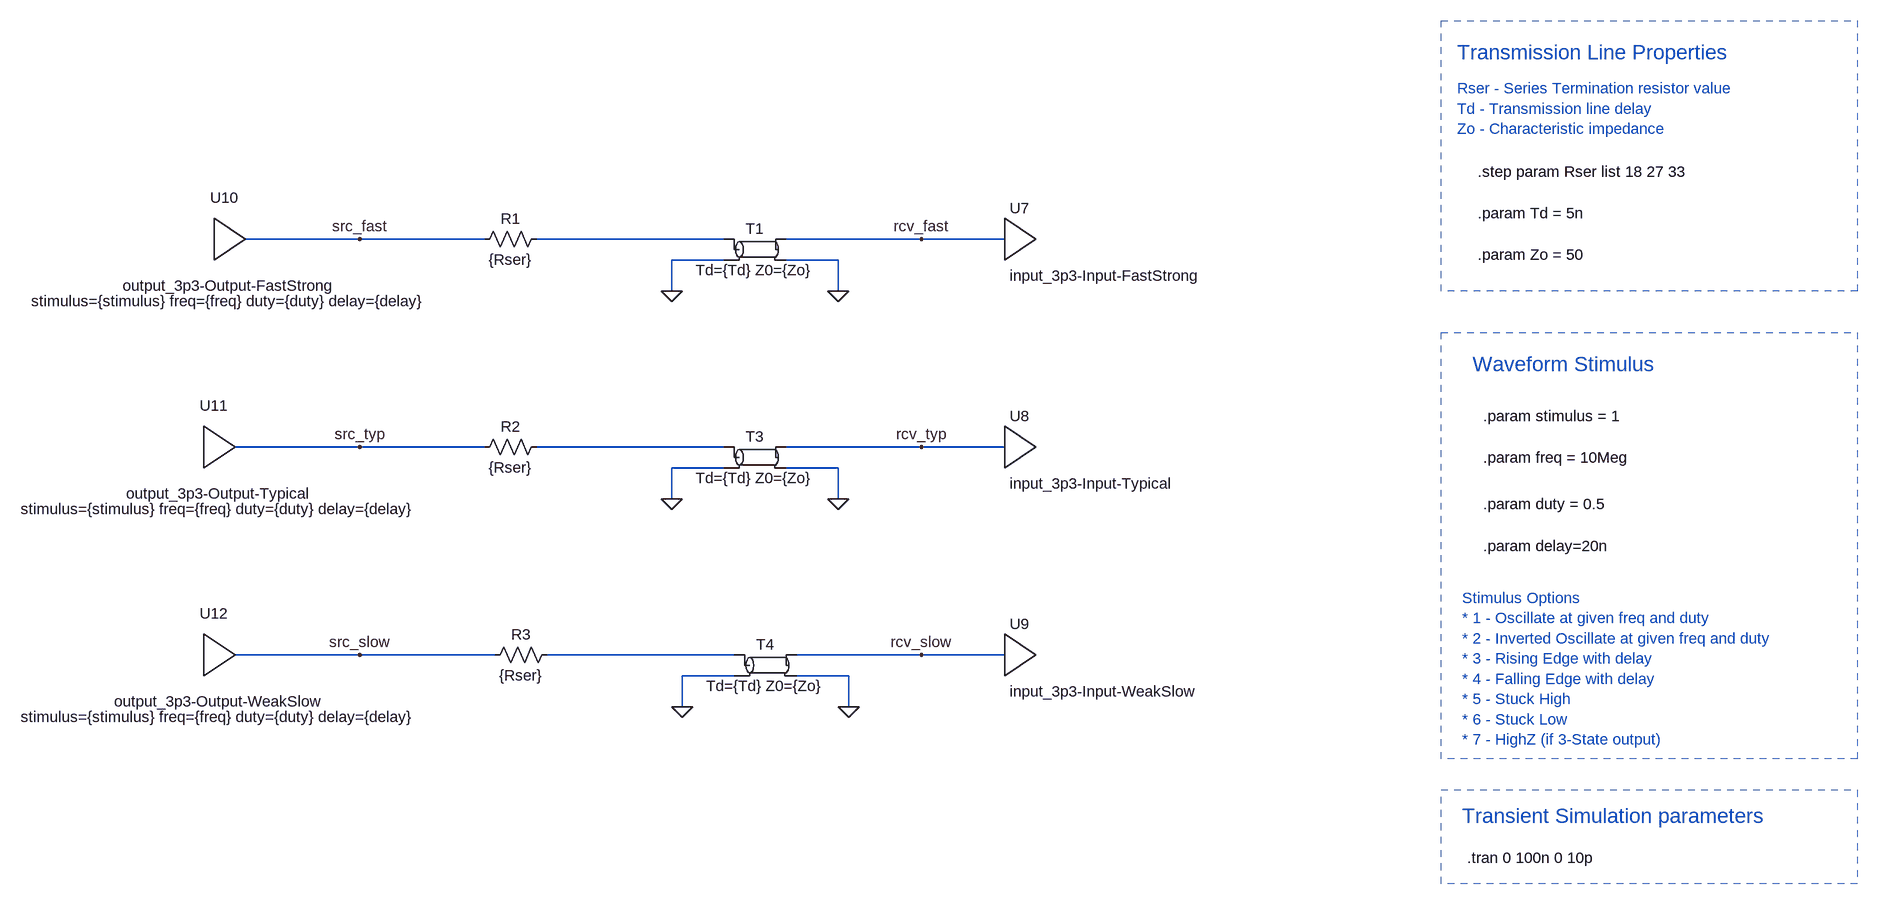
[diagram p0: schematic sn74lv1t34_33.asc]
sn74lv1t34_33.asc, the LTspice schematic file:
Version 4
SHEET 1 2068 1396
WIRE -240 304 -416 304
WIRE -48 304 -240 304
WIRE 320 304 32 304
WIRE 624 304 416 304
WIRE 752 304 624 304
WIRE 320 336 240 336
WIRE 496 336 416 336
WIRE 240 384 240 336
WIRE 496 384 496 336
WIRE -240 624 -432 624
WIRE -48 624 -240 624
WIRE 320 624 32 624
WIRE 624 624 416 624
WIRE 752 624 624 624
WIRE 320 656 240 656
WIRE 496 656 416 656
WIRE 240 704 240 656
WIRE 496 704 496 656
WIRE -240 944 -432 944
WIRE -32 944 -240 944
WIRE 336 944 48 944
WIRE 624 944 432 944
WIRE 752 944 624 944
WIRE 336 976 256 976
WIRE 512 976 432 976
WIRE 256 1024 256 976
WIRE 512 1024 512 976
FLAG 624 304 rcv_fast
FLAG 624 624 rcv_typ
FLAG 624 944 rcv_slow
FLAG -240 304 src_fast
FLAG -240 624 src_typ
FLAG -240 944 src_slow
FLAG 240 704 0
FLAG 496 704 0
FLAG 256 1024 0
FLAG 512 1024 0
FLAG 240 384 0
FLAG 496 384 0
SYMBOL res 48 288 R90
WINDOW 0 0 56 VBottom 2
WINDOW 3 32 56 VTop 2
SYMATTR InstName R1
SYMATTR Value {Rser}
SYMBOL res 48 608 R90
WINDOW 0 0 56 VBottom 2
WINDOW 3 32 56 VTop 2
SYMATTR InstName R2
SYMATTR Value {Rser}
SYMBOL res 64 928 R90
WINDOW 0 0 56 VBottom 2
WINDOW 3 32 56 VTop 2
SYMATTR InstName R3
SYMATTR Value {Rser}
SYMBOL tline 368 640 R0
SYMATTR InstName T3
SYMATTR Value Td={Td} Z0={Zo}
SYMBOL tline 384 960 R0
SYMATTR InstName T4
SYMATTR Value Td={Td} Z0={Zo}
SYMBOL tline 368 320 R0
SYMATTR InstName T1
SYMATTR Value Td={Td} Z0={Zo}
SYMBOL input_3p3-Input-FastStrong 752 240 R0
SYMATTR InstName U7
SYMBOL input_3p3-Input-Typical 752 560 R0
SYMATTR InstName U8
SYMBOL input_3p3-Input-WeakSlow 752 880 R0
SYMATTR InstName U9
SYMBOL output_3p3-Output-FastStrong -448 336 R0
SYMATTR InstName U10
SYMATTR SpiceLine stimulus={stimulus} freq={freq} duty={duty} delay={delay}
SYMBOL output_3p3-Output-Typical -464 656 R0
SYMATTR InstName U11
SYMATTR SpiceLine stimulus={stimulus} freq={freq} duty={duty} delay={delay}
SYMBOL output_3p3-Output-WeakSlow -464 976 R0
SYMATTR InstName U12
SYMATTR SpiceLine stimulus={stimulus} freq={freq} duty={duty} delay={delay}
TEXT 1464 1256 Left 2 !.tran 0 100n 0 10p
TEXT 1480 200 Left 2 !.step param Rser list 18 27 33
TEXT 1480 264 Left 2 !.param Td = 5n
TEXT 1480 328 Left 2 !.param Zo = 50
TEXT 1488 576 Left 2 !.param stimulus = 1
TEXT 1488 640 Left 2 !.param freq = 10Meg
TEXT 1488 712 Left 2 !.param duty = 0.5
TEXT 1488 776 Left 2 !.param delay=20n
TEXT 1448 16 Left 3 ;Transmission Line Properties
TEXT 1448 72 Left 2 ;Rser - Series Termination resistor value\nTd - Transmission line delay\nZo - Characteristic impedance
TEXT 1456 856 Left 2 ;Stimulus Options\n* 1 - Oscillate at given freq and duty\n* 2 - Inverted Oscillate at given freq and duty\n* 3 - Rising Edge with delay\n* 4 - Falling Edge with delay\n* 5 - Stuck High\n* 6 - Stuck Low\n* 7 - HighZ (if 3-State output)
TEXT 1456 1192 Left 3 ;Transient Simulation parameters
TEXT 1472 496 Left 3 ;Waveform Stimulus
RECTANGLE Normal 2064 1296 1424 1152 2
RECTANGLE Normal 2064 1104 1424 448 2
RECTANGLE Normal 2064 384 1424 -32 2

The netlist it stands for:
* sn74lv1t34_33.asc
R1 N001 src_fast {Rser}
R2 N002 src_typ {Rser}
R3 N003 src_slow {Rser}
T3 N002 0 rcv_typ 0 Td={Td} Z0={Zo}
T4 N003 0 rcv_slow 0 Td={Td} Z0={Zo}
T1 N001 0 rcv_fast 0 Td={Td} Z0={Zo}
XU7 rcv_fast input_3p3-Input-FastStrong  ; pins IN
XU8 rcv_typ input_3p3-Input-Typical  ; pins IN
XU9 rcv_slow input_3p3-Input-WeakSlow  ; pins IN
XU10 src_fast output_3p3-Output-FastStrong stimulus={stimulus} freq={freq} duty={duty} delay={delay}  ; pins OUT
XU11 src_typ output_3p3-Output-Typical stimulus={stimulus} freq={freq} duty={duty} delay={delay}  ; pins OUT
XU12 src_slow output_3p3-Output-WeakSlow stimulus={stimulus} freq={freq} duty={duty} delay={delay}  ; pins OUT
.tran 0 100n 0 10p
.step param Rser list 18 27 33
.param Td = 5n
.param Zo = 50
.param stimulus = 1
.param freq = 10Meg
.param duty = 0.5
.param delay=20n
* Transmission Line Properties
* Rser - Series Termination resistor value
* Td - Transmission line delay
* Zo - Characteristic impedance
* Stimulus Options
* * 1 - Oscillate at given freq and duty
* * 2 - Inverted Oscillate at given freq and duty
* * 3 - Rising Edge with delay
* * 4 - Falling Edge with delay
* * 5 - Stuck High
* * 6 - Stuck Low
* * 7 - HighZ (if 3-State output)
* Transient Simulation parameters
* Waveform Stimulus
.lib input_3p3-Input-FastStrong.sub
.lib input_3p3-Input-Typical.sub
.lib input_3p3-Input-WeakSlow.sub
.lib output_3p3-Output-FastStrong.sub
.lib output_3p3-Output-Typical.sub
.lib output_3p3-Output-WeakSlow.sub
.backanno
.end